# EAGLE design E106 (EAGLE 9.5.1)
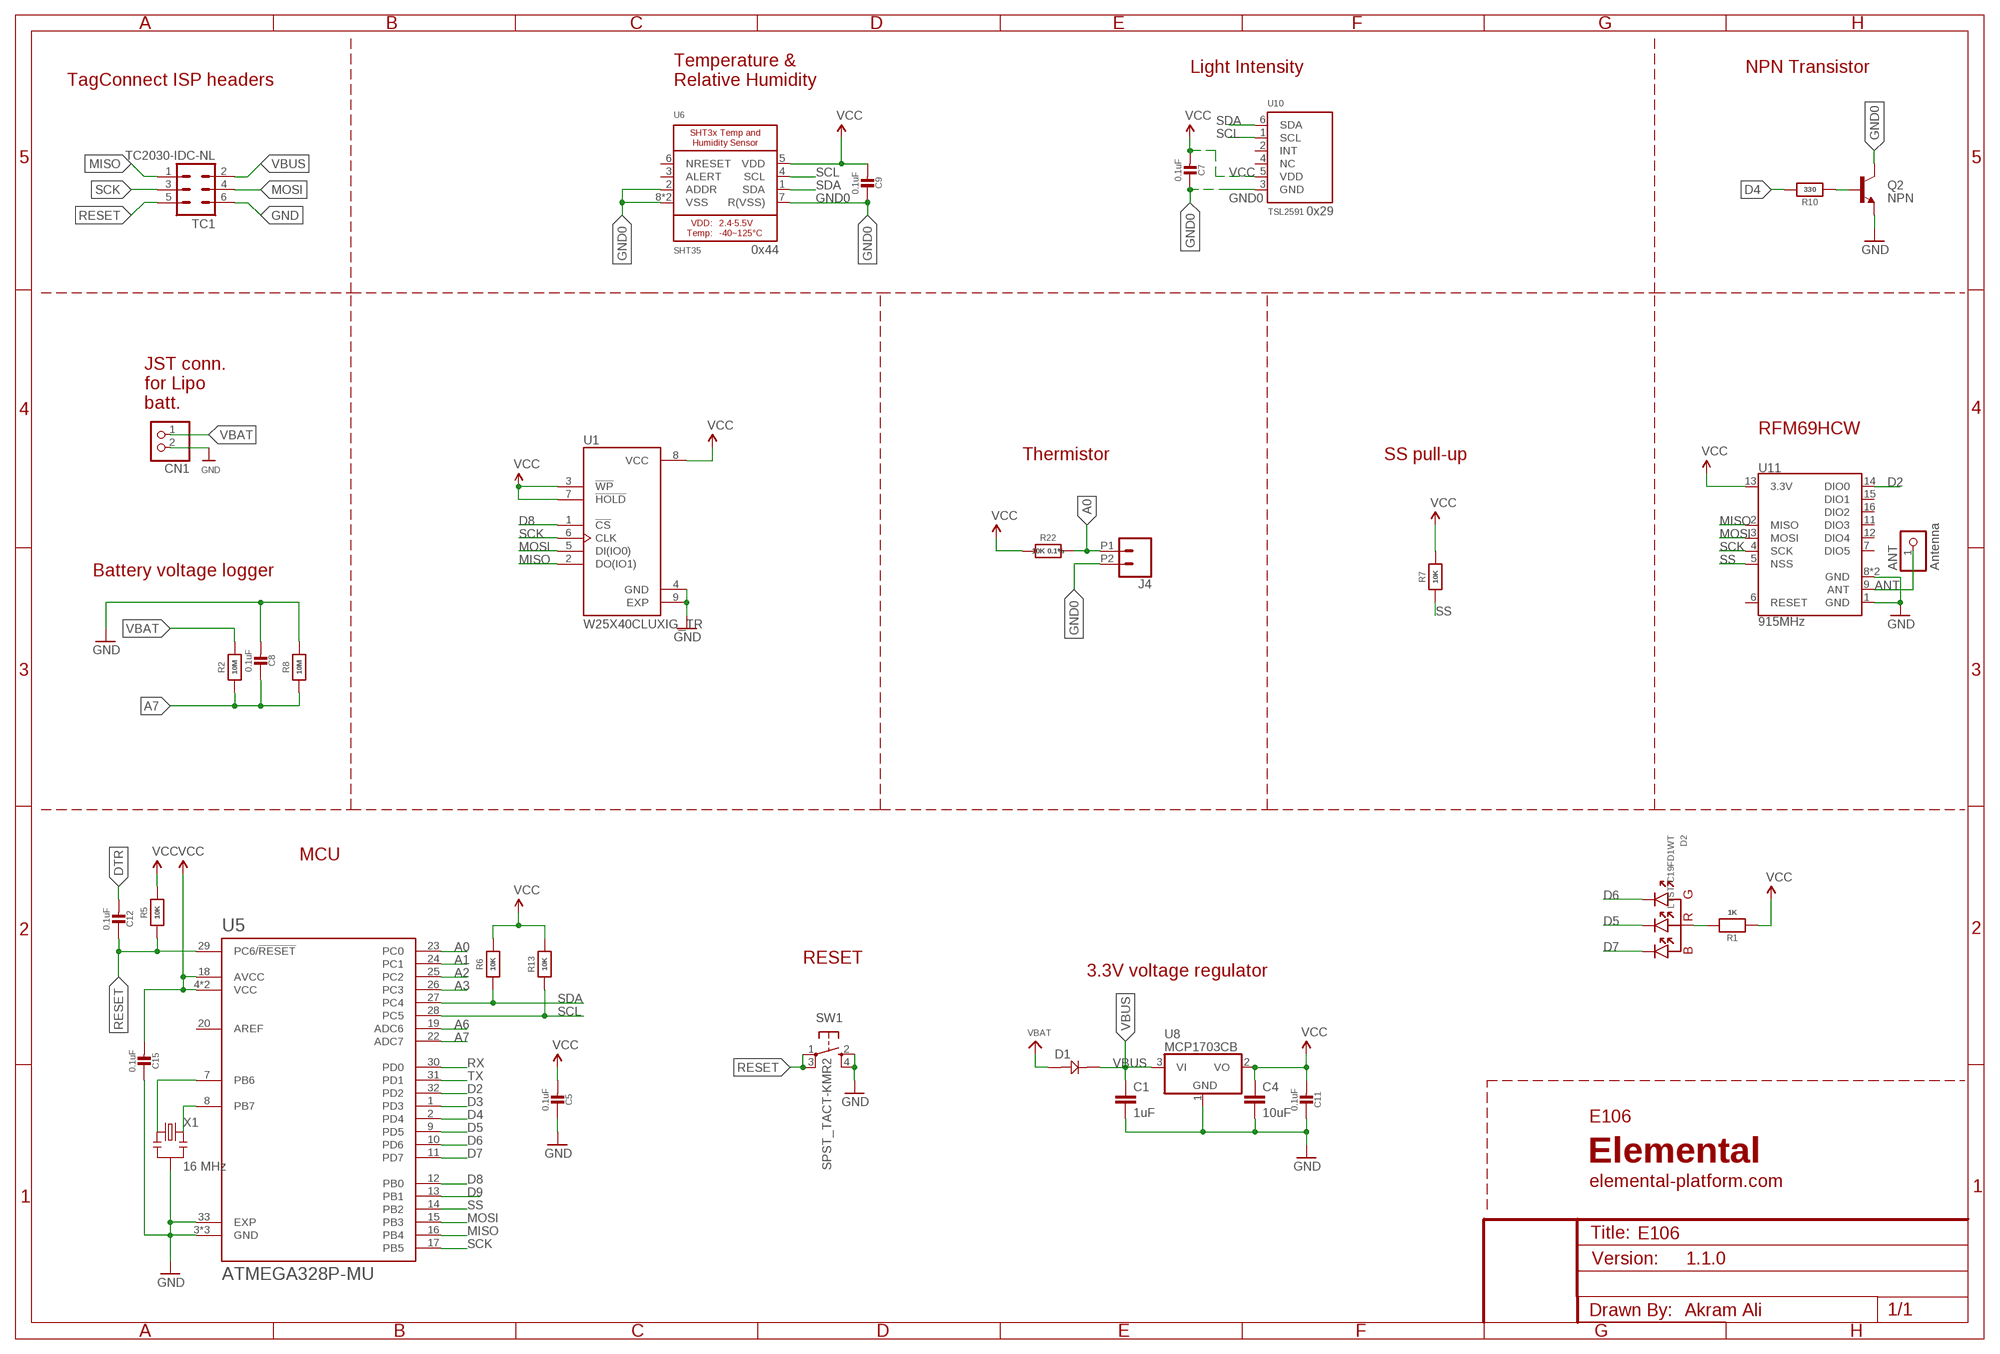
[diagram p0: schematic, sheet 1]

## Parts
ANT  Antenna  PINHD-1X1CB  [1X01-CLEANBIG]
C1  1uF  CAP0805  [0805]
C4  10uF  CAP0805  [0805]
C5  0.1uF  MICROBUILDER_CAP_CERAMIC_0402MP  [MICROBUILDER__0402MP]
C7  0.1uF  MICROBUILDER_CAP_CERAMIC_0402MP  [MICROBUILDER__0402MP]
C8  0.1uF  MICROBUILDER_CAP_CERAMIC_0402MP  [MICROBUILDER__0402MP]
C9  0.1uF  MICROBUILDER_CAP_CERAMIC_0402MP  [MICROBUILDER__0402MP]
C11  0.1uF  MICROBUILDER_CAP_CERAMIC_0402MP  [MICROBUILDER__0402MP]
C12  0.1uF  MICROBUILDER_CAP_CERAMIC_0402MP  [MICROBUILDER__0402MP]
C15  0.1uF  MICROBUILDER_CAP_CERAMIC_0402MP  [MICROBUILDER__0402MP]
CN1  JST_2PIN-SMT-RA  [JST-PH-2-SMT-RA]
D1  DIODE_SCHOTTKY0805-RES  [0805]
D2  LTST-C19FD1WT  [4-SMD]
J4  CONN_022.54MM_SCREWTERM  [1X02_2.54_SCREWTERM]
Q2  NPN  TRANSISTOR_NPNMMBT5088  [SOT23-3@1]
R1  1K  MICROBUILDER_RESISTOR_0402MP  [MICROBUILDER__0402MP]
R2  10M  MICROBUILDER_RESISTOR_0402MP  [MICROBUILDER__0402MP]
R5  10K  MICROBUILDER_RESISTOR_0402MP  [MICROBUILDER__0402MP]
R6  10K  MICROBUILDER_RESISTOR_0402MP  [MICROBUILDER__0402MP]
R7  10K  MICROBUILDER_RESISTOR_0402MP  [MICROBUILDER__0402MP]
R8  10M  MICROBUILDER_RESISTOR_0402MP  [MICROBUILDER__0402MP]
R10  330  MICROBUILDER_RESISTOR_0402MP  [MICROBUILDER__0402MP]
R13  10K  MICROBUILDER_RESISTOR_0402MP  [MICROBUILDER__0402MP]
R22  10K 0.1%  MICROBUILDER_RESISTOR_0402MP  [MICROBUILDER__0402MP]
SW1  SPST_TACT-KMR2  [KMR2]
TC1  TC2030-IDC-NL  [TC2030-IDC-NL]
U1  W25X40CLUXIG_TR  [PSON50P300X200X60-9N]
U5  ATMEGA328P-MU  [QFN50P500X500X100-33N]
U6  SHT35  SHT3X  [SHT3X]
U8  MCP1703CB  [SOT23]
U10  TSL2591  LIGHT_TSL2591  [DFN6_TAOS]
U11  915MHz  RFM69HCW-915  [RFM69HCW-XXXS2]
X1  16 MHz  RESONATORSMD  [RESONATOR-SMD]

## Nets
A0: J4.P1 R22.2 U5.23(PC0)
A1: U5.24(PC1)
A2: U5.25(PC2)
A3: U5.26(PC3)
A6: U5.19(ADC6)
A7: C8.1 R2.1 R8.1 U5.22(ADC7)
ANT: ANT.1 U11.9(ANT)
D2: U5.32(PD2) U11.14(DIO0)
D3: U5.1(PD3)
D4: R10.2 U5.2(PD4)
D5: D2.2(C2) U5.9(PD5)
D6: D2.3(C3) U5.10(PD6)
D7: D2.1(C1) U5.11(PD7)
D8: U1.1(!CS) U5.12(PB0)
D9: U5.13(PB1)
DTR: C12.2
GND: C1.2 C4.2 C5.1 C8.2 C11.1 C15.1 CN1.2 Q2.2(E) R8.2 SW1.2(S) SW1.4(S1) TC1.6 U1.4(GND) U1.9(EXP) U5.3(GND) U5.5(GND) U5.21(GND) U5.33(EXP) U8.1(GND) U11.1(GND) U11.8(GND) U11.10(GND) X1.2
GND0: C7.1 C9.1 J4.P2 Q2.3(C) U6.2(ADDR) U6.7(R(VSS)) U6.8(VSS) U6.THERMAL(VSS) U10.3(GND)
MISO: TC1.1 U1.2(DO(IO1)) U5.16(PB4) U11.2(MISO)
MOSI: TC1.4 U1.5(DI(IO0)) U5.15(PB3) U11.3(MOSI)
N$4: U5.8(PB7) X1.3
N$5: U5.7(PB6) X1.1
N$6: D2.4(A) R1.2
N$7: Q2.1(B) R10.1
RESET: C12.1 R5.1 SW1.1(P) SW1.3(P1) TC1.5 U5.29(PC6/!RESET)
RX: U5.30(PD0)
SCK: TC1.3 U1.6(CLK) U5.17(PB5) U11.4(SCK)
SCL: R13.1 U5.28(PC5) U6.4(SCL) U10.1(SCL)
SDA: R6.1 U5.27(PC4) U6.1(SDA) U10.6(SDA)
SS: R7.1 U5.14(PB2) U11.5(NSS)
TX: U5.31(PD1)
VBAT: CN1.1 D1.1 R2.2
VBUS: C1.1 D1.2 TC1.2 U8.3(VI)
VCC: C4.1 C5.2 C7.2 C9.2 C11.2 C15.2 R1.1 R5.2 R6.2 R7.2 R13.2 R22.1 U1.3(!WP) U1.7(!HOLD) U1.8(VCC) U5.4(VCC) U5.6(VCC) U5.18(AVCC) U6.5(VDD) U8.2(VO) U10.5(VDD) U11.13(3.3V)
Unconnected: U5.20(AREF) U6.3(ALERT) U6.6(NRESET) U10.2(INT) U10.4(NC) U11.6(RESET) U11.7(DIO5) U11.11(DIO3) U11.12(DIO4) U11.15(DIO1) U11.16(DIO2)

## Notes on the sheet
- Light Intensity | NPN Transistor
- TagConnect ISP headers
- Temperature &
  Relative Humidity
- 0x29
- 0x44
- JST conn.
  for Lipo
  batt.
- RFM69HCW
- Thermistor | SS pull-up
- Battery voltage logger
- MCU
- RESET
- 3.3V voltage regulator
- E106
- Elemental
- elemental-platform.com
- 1.1.0
- Akram Ali

## Library data of the parts
ANT = adafruit@1:PINHD-1X1: Pin header 1x1 for 0.1" spacing With round pins; MPN: Helical antenna
C1 = SparkFun-Capacitors:CAP: Capacitor Standard 0603 ceramic capacitor, and 0.1" leaded capacitor.; MPN: CC0805ZRY5V8BB105
C4 = SparkFun-Capacitors:CAP: Capacitor Standard 0603 ceramic capacitor, and 0.1" leaded capacitor.; MPN: CC0805KKX5R6BB106
C5 C7-C9 C11 C12 C15 = Adafruit Feather 32u4 Bluefruit LE:MICROBUILDER_CAP_CERAMIC: Ceramic Capacitors For new designs, use the packages preceded by an '_' character since they are more reliable: The following footprints should be used on most boards: _0402 - Standard footprint for regular board layouts _0603 - Standard footprint for regular board layouts _0805 - Standard footprint for regular board layouts _1206 - Standard footprint for regular board layouts For extremely tight-pitch boards where space is at a premium, the following 'micro-pitch' footprints can be used (smaller pads, no silkscreen outline, etc.): _0402MP - Micro-pitch footprint for very dense/compact boards _0603MP - Micro-pitch footprint for very dense/compact boards _0805MP - Micro-pitch footprint for very dense/compact boards _1206MP - Micro-pitch footprint for very dense/compact boards; MPN: GRM155R71C104KA88J
CN1 = adafruit:JST_2PIN: JST 2-Pin Connectors of various flavors SMT-RA (S2B-PH-SM4) 4UConnector #17311 SMT (B2B-PH-SM4) THM-RA (S2B-PH) THM (B2B-PH)
D1 = SCHOTTKY_0805:DIODE_SCHOTTKY
D2 = LTST-C19FD1WT:LTST-C19FD1WT; AVAILABILITY: Unavailable; DESCRIPTION: Blue/Red/Green 2.1 x 1.6 x 0.55 mm 130° 180/450/180 mcd 3.5/3.5/2 V Chip LED; MF: Lite-On Inc.; MP: LTST-C19FD1WT; PACKAGE: SMD-4 Lite-On; PRICE: None
J4 = SparkFun-Connectors:CONN_02: Multi connection point. Often used as Generic Header-pin footprint for 0.1 inch spaced/style header connections On any of the 0.1 inch spaced packages, you can populate with these: Break Away Headers - Straight <https://www.sparkfun.com/products/116> (PRT-00116) Break Away Male Headers - Right Angle <https://www.sparkfun.com/products/553> (PRT-00553) Female Headers <https://www.sparkfun.com/products/115> (PRT-00115) Break Away Headers - Machine Pin <https://www.sparkfun.com/products/117> (PRT-00117) Break Away Female Headers - Swiss Machine Pin <https://www.sparkfun.com/products/743> (PRT-00743) For SCREWTERMINALS and SPRING TERMINALS visit here: Screw Terimnals on SparkFun.com <https://www.sparkfun.com/search/results?term=Screw+Terminals> (5mm/3.5mm/2.54mm spacing) This device is also useful as a general connection point to wire up your design to another part of your project. Our various solder wires solder well into these plated through hole pads. Hook-Up Wire - Assortment (Stranded, 22 AWG) <https://www.sparkfun.com/products/11375> (PRT-11375) Hook-Up Wire - Assortment (Solid Core, 22 AWG) <https://www.sparkfun.com/products/11367> (PRT-11367) View the entire wire category on our website here <https://www.sparkfun.com/categories/141> Special notes: Molex polarized connector foot print use with: PRT-08233 with associated crimp pins and housings. 2.54_SCREWTERM for use with PRT-10571. 3.5mm Screw Terminal footprints for PRT-08084 5mm Screw Terminal footprints for use with PRT-08432
Q2 = SparkFun-DiscreteSemi:TRANSISTOR_NPN: Generic NPN BJT MMBT2222A - TRANS-08049 (SOT-23, 1A 40V) MPSA42 - TRANS-09116 (SOT-23, 500mA 300V) MMBT5088LT1G - TRANS-11160 (SOT-23, 50 mA 30V) BC547 - COM-08928 <http://www.sparkfun.com/products/8928> (TO-92 45V 100mA) (1.Collector 2.Base 3.Emitter) 2N3904 - COM-00521 <http://www.sparkfun.com/products/521> (TO-92 40V 200mA) (1.Emitter 2.Base 3.Collector) P2N2222A - COM-12852 <http://www.sparkfun.com/products/12852> (TO-92 40V 600mA) (1.Collector 2.Base 3.Emitter); PROD_ID: TRANS-11160; VALUE: MMBT5088
R1 R2 R5-R8 R10 R13 = Adafruit Feather 32u4 Bluefruit LE:MICROBUILDER_RESISTOR: Resistors For new designs, use the packages preceded by an '_' character since they are more reliable: The following footprints should be used on most boards: _0402 - Standard footprint for regular board layouts _0603 - Standard footprint for regular board layouts _0805 - Standard footprint for regular board layouts _1206 - Standard footprint for regular board layouts For extremely tight-pitch boards where space is at a premium, the following 'micro-pitch' footprints can be used (smaller pads, no silkscreen outline, etc.): _0402MP - Micro-pitch footprint for very dense/compact boards _0603MP - Micro-pitch footprint for very dense/compact boards _0805MP - Micro-pitch footprint for very dense/compact boards _1206MP - Micro-pitch footprint for very dense/compact boards; MPN: RC0402JR-0710KL
R22 = Adafruit Feather 32u4 Bluefruit LE:MICROBUILDER_RESISTOR: Resistors For new designs, use the packages preceded by an '_' character since they are more reliable: The following footprints should be used on most boards: _0402 - Standard footprint for regular board layouts _0603 - Standard footprint for regular board layouts _0805 - Standard footprint for regular board layouts _1206 - Standard footprint for regular board layouts For extremely tight-pitch boards where space is at a premium, the following 'micro-pitch' footprints can be used (smaller pads, no silkscreen outline, etc.): _0402MP - Micro-pitch footprint for very dense/compact boards _0603MP - Micro-pitch footprint for very dense/compact boards _0805MP - Micro-pitch footprint for very dense/compact boards _1206MP - Micro-pitch footprint for very dense/compact boards; MPN: RC0402JR-0727RL
SW1 = adafruit:SPST_TACT: SMT 6mm switch, EVQQ2 series http://www.ladyada.net/library/eagle
TC1 = TagConnect:TC2030-IDC: Tag-Connect In Circuit Programming & Debug Cable 6 Pin http://www.tag-connect.com
U1 = W25X40CLUXIG_TR:W25X40CLUXIG_TR: Spiflash, 4m-Bit, 4kb Uniform Se; DESCRIPTION: Spiflash, 4m-Bit, 4kb Uniform Se; DIGI-KEY_PART_NUMBER: W25X40CLUXIGCT-ND; DIGI-KEY_PURCHASE_URL: https://www.digikey.com/product-detail/en/winbond-electronics/W25X40CLUXIG-TR/W25X40CLUXIGCT-ND/5764888?utm_source=snapeda&utm_medium=aggregator&utm_campaign=symbol; MF: Winbond Electronics; MP: W25X40CLUXIG TR; PACKAGE: UFDFN-8 Winbond
U5 = ATMEGA328P-MU:ATMEGA328P-MU: ATmega Series 20 MHz 32 KB Flash 2 KB SRAM 8-Bit Microcontroller - QFN-32; AVAILABILITY: Good; DESCRIPTION: ATmega Series 20 MHz 32 KB Flash 2 KB SRAM 8-Bit Microcontroller - QFN-32; MF: Atmel; MP: ATMEGA328P-MU; MPN: ATMEGA328P-MU; PACKAGE: QFN-32 Atmel; PRICE: 2.55 USD
U6 = Adafruit SHT31:SHT3X: SHT3x - Digital Temperature and Humidity Sensor Supply Voltage: 2.4-5.5V Humidity Accuracy: SHT30 = +/-3%RH, SHT31 = +/-2%RH Temperature Sensor: -40~125°C (+/-0.3°C from 10-55C); MPN: SHT35-DIS-B
U8 = linear:MCP1703: 250 mA, 16V, Low Quiescent Current LDO Regulator Source: http://ww1.microchip.com/downloads/en/DeviceDoc/22049b.pdf; MPN: MCP1703T-3302E/CB; OC_NEWARK: 18T9177
U10 = TSL2591:LIGHT_TSL2591: TSL2591 Light-To-Digital Sensor; MPN: TSL25911FN
U11 = SparkFun-RF:RFM69H: Hope RF RFM69H ISM Transceiver Module The RFM69H is a transceiver module capable of operation over a wide frequency range, including the 315,433,868 and 915MHz license-free ISM (Industry Scientific and Medical) frequency bands. All major RF communication parameters are programmable and most of them can be dynamically set. The RFM69H offers the unique advantage of programmable narrow-band and wide- band communication modes. The RFM69H is optimized for low power consumption while offering high RF output power and channelized operation.Compliance ETSI and FCC regulations. Datasheet <http://www.hoperf.cn/upload/docs/RF/SX/RFM69H_DataSheet_v1.3.pdf> SparkFun Products RFM69HCW Wireless Transceiver - 915MHz <https://www.sparkfun.com/products/13909> (COM-13909) RFM69HCW Wireless Transceiver - 434MHz <https://www.sparkfun.com/products/13910> (COM-13910) SparkFun RFM69 Breakout (915MHz) <https://www.sparkfun.com/products/12775> (WRL-12775) SparkFun RFM69 Breakout (434MHz) <https://www.sparkfun.com/products/12823> (WRL-12823); MPN: RFM69HCW; PROD_ID: IC-11997
X1 = SparkFun:RESONATOR: Resonator Small SMD resonator. This is the itty bitty 10/20MHz resonators with built in caps. CSTCE10M0G55 and CSTCE20M0V53. Footprint has been reviewed closely but hasn't been tested yet.; MPN: CSTCE16M0V53-R0

## Net classes
1 power: width 0.381 mm, clearance 0.254 mm

## Board
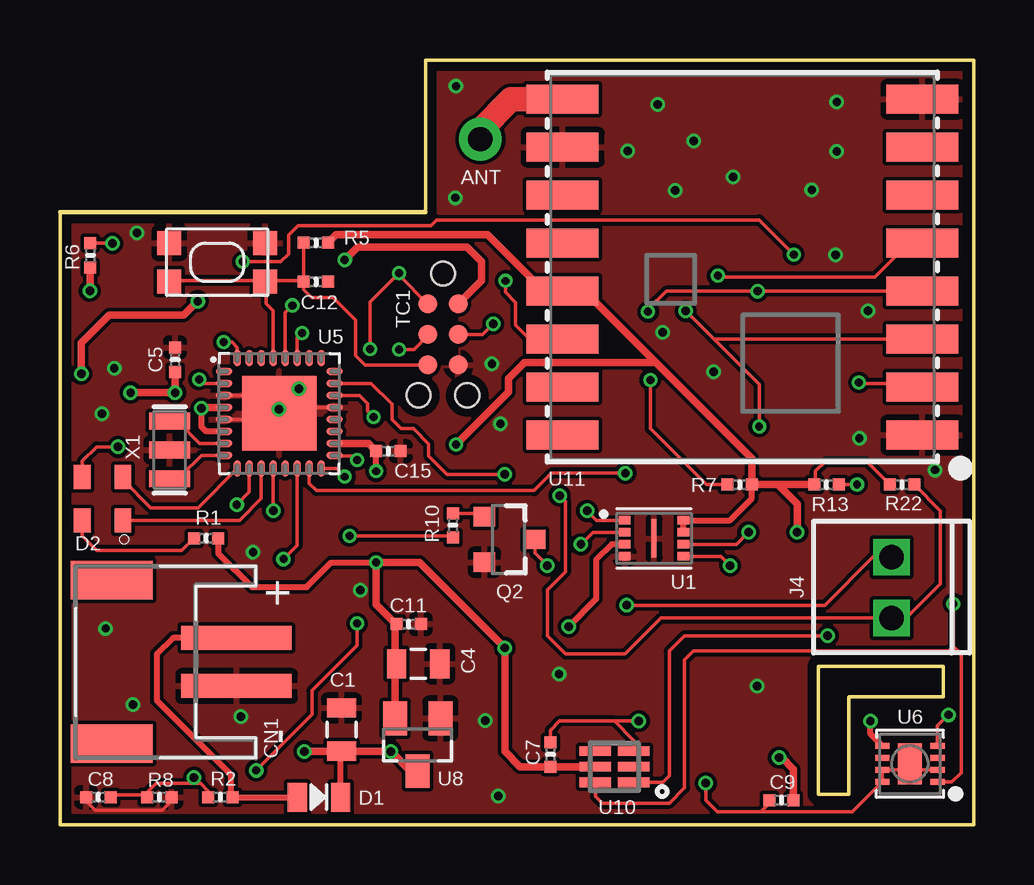
[diagram p1: board, top side]
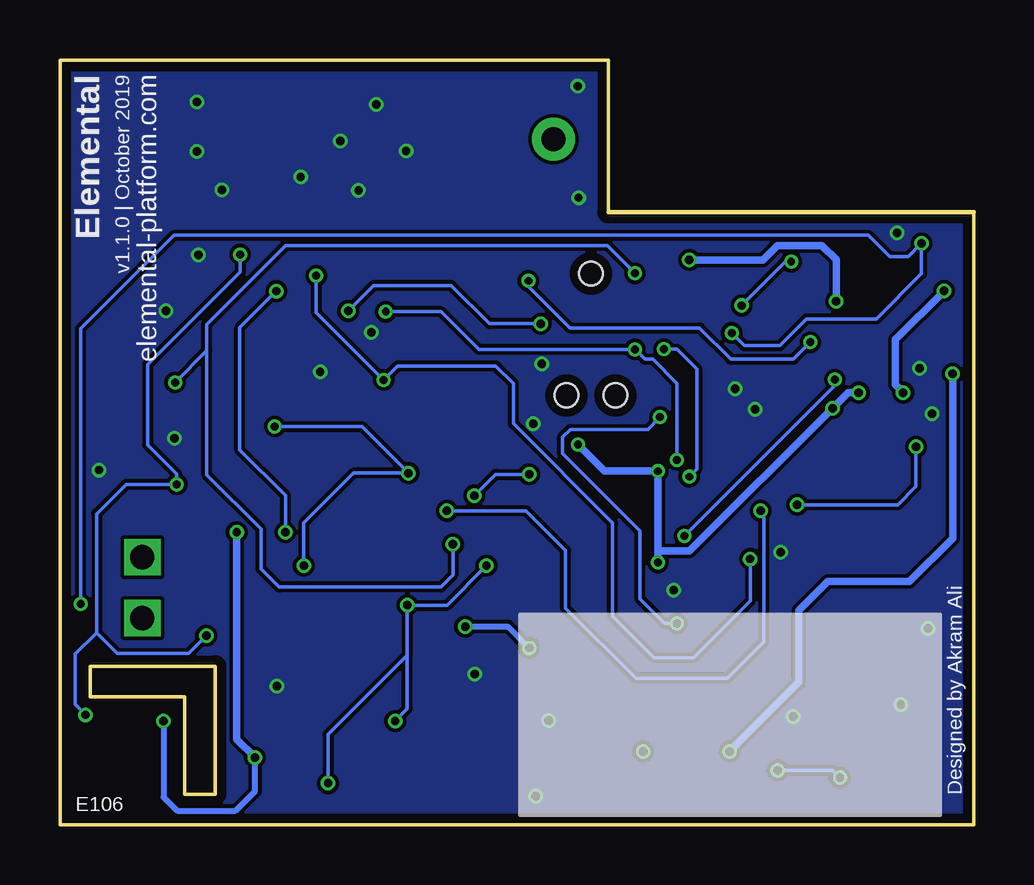
[diagram p2: board, bottom side, seen from below]

Size 38.1 x 31.88 mm. Coordinates in mm from the lower left corner, seen from the top.
Outline: 0,25.53 15.24,25.53 15.24,31.88 38.1,31.88 38.1,0 0,0 0,25.53
Outline: 36.83,6.6 31.62,6.6 31.62,1.27 32.89,1.27 32.89,5.33 36.83,5.33 36.83,6.6
Copper layers (1*16): Top 0.035559375mm / dielectric 1.6mm / Bottom 0.035559375mm
Design rules "oshpark-2layer *": minimum track width 6mil, minimum drill 10mil, track to track 6mil, track to pad 6mil, pad to pad 6mil, via to via 6mil, smd to smd 6mil, copper to edge 15mil, drill to drill 6mil, minimum pad ring 5mil, minimum via ring 5mil, stop-mask expansion 2.5mil, vias tented up to drill 14mil, thermal gap 10mil

### Footprints (pad centres in the part's own frame; a part is rotated, then mirrored left to right if it is on the bottom)
1X01-CLEANBIG = drill 1.016 pad 1.778: 1 0,0
0805 = smd 0.8 x 1.2: 1 -0.9,0; 2 0.9,0
MICROBUILDER__0402MP = smd 0.5 x 0.5: 1 -0.508,0; 2 0.508,0
JST-PH-2-SMT-RA = smd 1 x 4.6: 1 1,-3.7; 2 -1,-3.7 | smd 1.6 x 3.4: NC1 -3.4,1.5; NC2 3.4,1.5
4-SMD = smd 1 x 0.7: 1 0.9,0.85; 2 -0.9,0.85; 3 -0.9,-0.85; 4 0.9,-0.85
1X02_2.54_SCREWTERM = drill 1.016 square: P1 2.54,0; P2 0,0
SOT23-3@1 = smd 0.8 x 0.9: 1 -0.95,-1; 2 0.95,-1; 3 0,1.1
KMR2 = smd 1 x 1: 1 2,0.8; 2 2,-0.8; 3 -2,0.8; 4 -2,-0.8
TC2030-IDC-NL = smd 0.787 x 0.787: 1 -1.27,-0.635; 2 -1.27,0.635; 3 0,-0.635; 4 0,0.635; 5 1.27,-0.635; 6 1.27,0.635 | hole 0.991: -2.54,0; 2.54,1.016; 2.54,-1.016
PSON50P300X200X60-9N = smd 0.49 x 0.35: 1 -1.22,0.75; 2 -1.22,0.25; 3 -1.22,-0.25; 4 -1.22,-0.75; 5 1.22,-0.75; 6 1.22,-0.25; 7 1.22,0.25; 8 1.22,0.75 | smd 0.2 x 1.6: 9 0,0
QFN50P500X500X100-33N = smd 0.7 x 0.3: 1 -2.3,1.75; 2 -2.3,1.25; 3 -2.3,0.75; 4 -2.3,0.25; 5 -2.3,-0.25; 6 -2.3,-0.75; 7 -2.3,-1.25; 8 -2.3,-1.75; 17 2.3,-1.75; 18 2.3,-1.25; 19 2.3,-0.75; 20 2.3,-0.25; 21 2.3,0.25; 22 2.3,0.75; 23 2.3,1.25; 24 2.3,1.75 | smd 0.3 x 0.7: 9 -1.75,-2.3; 10 -1.25,-2.3; 11 -0.75,-2.3; 12 -0.25,-2.3; 13 0.25,-2.3; 14 0.75,-2.3; 15 1.25,-2.3; 16 1.75,-2.3; 25 1.75,2.3; 26 1.25,2.3; 27 0.75,2.3; 28 0.25,2.3; 29 -0.25,2.3; 30 -0.75,2.3; 31 -1.25,2.3; 32 -1.75,2.3 | smd 3.1 x 3.1: 33 0,0
SHT3X = smd 0.6 x 0.25: 1 -1.15,0.75; 2 -1.15,0.25; 3 -1.15,-0.25; 4 -1.15,-0.75; 5 1.15,-0.75; 6 1.15,-0.25; 7 1.15,0.25; 8 1.15,0.75 | smd 1 x 1.7: THERMAL 0,0
SOT23 = smd 1 x 1.4: 1 -0.95,-1.1; 2 0.95,-1.1; 3 0,1.1
DFN6_TAOS = smd 1.3 x 0.4: 1 -0.8,0.65; 2 -0.8,0; 3 -0.8,-0.65; 4 0.8,-0.65; 5 0.8,0; 6 0.8,0.65
RFM69HCW-XXXS2 = smd 3 x 1.2: 1 -7.5,7; 2 -7.5,5; 3 -7.5,3; 4 -7.5,1; 5 -7.5,-1; 6 -7.5,-3; 7 -7.5,-5; 8 -7.5,-7; 9 7.5,-7; 10 7.5,-5; 11 7.5,-3; 12 7.5,-1; 13 7.5,1; 14 7.5,3; 15 7.5,5; 16 7.5,7
RESONATOR-SMD = smd 0.7 x 1.7: 1 -1.2,0; 2 0,0; 3 1.2,0

### Placement (x,y rotation side)
ANT  17.53,28.57 0 top
C1  11.73,3.96 90 top
C4  14.94,6.71 0 top
C5  4.8,19.38 270 top
C7  20.45,2.92 270 top
C8  1.6,1.14 180 top
C9  30.07,1.02 0 top
C11  14.54,8.36 180 top
C12  10.67,22.63 0 top
C15  13.69,15.57 180 top
CN1  3.66,6.78 90 top
D1  10.79,1.14 0 top
D2  1.78,13.59 270 top
J4  34.67,11.15 270 top
Q2  18.69,11.89 270 top
R1  6.1,11.94 180 top
R2  6.68,1.14 0 top
R5  10.67,24.26 0 top
R6  1.27,23.72 270 top
R7  28.33,14.17 0 top
R8  4.14,1.14 0 top
R10  16.38,12.47 270 top
R13  31.95,14.17 180 top
R22  35.1,14.17 0 top
SW1  6.55,23.44 180 top
TC1  15.96,20.43 270 top
U1  24.77,11.94 0 top
U5  9.14,17.15 0 top
U6  35.43,2.53 180 top
U8  14.91,3.33 180 top
U10  23.11,2.41 180 top
U11  28.45,23.24 180 top
X1  4.57,15.62 270 top

### Tracks (layer width: path | path; a pad name or v marks a point on that pad's centre or on a via)
A0  (via drill 0.35)
  Top 0.152: R22.2 36.7,13.08 36.7,10.03 35.28,8.61 J4.P1 25.04,8.61 23.55,7.11 21.08,7.11 20.32,7.87 20.32,9.78 21.08,10.54 21.08,13.46 v20.83,13.72 | U5.23 12.97,18.4 13.84,17.53 13.84,16.89 14.22,16.51 14.73,16.51 15.37,15.88 15.37,15.37 16.13,14.6 v18.54,14.6
  Bottom 0.152: v20.83,13.72 19.94,14.6 v18.54,14.6
A7  (via drill 0.33, 0.35)
  Top 0.152: C8.1 2.22,1.24 3.49,1.24 R8.1 3.63,1.35 4,1.71 5.35,1.71 | R2.1 6.17,1.4 5.86,1.71 5.35,1.71 | v12.38,8.38 12.38,7.46 10.51,5.59 10.51,4.59 v8.18,2.26 | U5.22 12.49,17.9 12.83,17.56 12.83,17.24 v13.08,16.99 | v5.59,1.96 5.35,1.71
  Bottom 0.152: v12.38,8.38 12.9,8.38 13.92,9.4 13.92,12.24 17.14,15.47 17.14,16.16 16.83,16.48 13.59,16.48 v13.08,16.99 | v8.18,2.26 5.89,2.26 v5.59,1.96
ANT
  Top 1.016: U11.9 18.81,30.24 17.53,28.96 ANT.1
D2  (via drill 0.33)
  Top 0.152: v18.57,22.67 18.57,22.19 19,21.77 19,20.83 19.54,20.29 20.8,20.29 U11.14 | U5.32 7.39,19.89 7.17,20.11 v6.82,20.11
  Bottom 0.152: v18.57,22.67 18.57,22.43 16.84,20.7 11.44,20.7 10.14,19.41 7.53,19.41 v6.82,20.11
D4  (via drill 0.33)
  Top 0.152: U5.2 5.96,18.4 v5.8,18.55 | R10.2 16.31,12.03 v12.06,12.03
  Bottom 0.152: v12.06,12.03 5.8,18.3 v5.8,18.55
D5
  Top 0.152: U5.9 5.76,13.21 3.78,13.21 2.63,14.36 D2.2
D6  (via drill 0.35)
  Top 0.152: U5.10 7.89,13.86 v7.37,13.34 | D2.3 0.93,15.15 1.52,15.75 v2.41,15.75
  Bottom 0.152: v7.37,13.34 3.17,13.34 2.41,14.1 v2.41,15.75
D7
  Top 0.152: U5.11 8.39,13.6 7.48,12.69 D2.1
D8  (via drill 0.35)
  Top 0.152: U5.12 v8.89,13.09 v8.89,13.08 | v21.97,13.08 22.36,12.69 U1.1
  Bottom 0.152: v21.97,13.08 18.67,13.08 17.02,11.43 17.02,9.02 14.1,6.1 10.29,6.1 8.76,7.62 8.76,12.95 v8.89,13.08
GND  (via drill 0.35)
  Top 0.152: U5.21 10.72,17.4 v9.96,18.16 | U5.5 8.69,16.9 v9.12,17.32 8.55,17.9 U5.3 | C8.2 1.09,0.97 1.46,0.6 4.25,0.6 4.65,1 R8.2
  other vias: 7.54,4.5 18.01,19.2 24.92,30.02 26.42,28.5 31.34,26.47 28.07,27 16.51,30.78 16.48,26.14 3.05,5 33.32,16.1 8.05,11.35 3.2,24.66 2.26,19.02 1.91,8.18 18.36,16.71 27.25,18.87 33.68,21.41 32.33,23.75 25.65,26.44 32.38,30.12 23.67,28.09 32.38,28.07 25.12,20.52 17.73,4.34 36.47,14.78 12.52,9.78 18.26,1.19 29.06,5.77 20.8,6.27 1.75,17.12
  pour Top (rank 6): 39.37,33.15 39.37,-1.27 -1.27,-1.27 -1.27,33.15
  pour Bottom: -1.52,33.4 39.62,33.4 39.62,-1.52 -1.52,-1.52
GND0  (via drill 0.35)
  Top 0.152: J4.P2 33.88,11.15 31.88,9.14 v23.62,9.14 | U6.2 35.68,2.28 U6.THERMAL 35.18,2.28 U6.7 U6.8 33.04,0.53 29.21,0.53 | 29.21,0.53 27.41,0.53 26.92,1.02 v26.92,1.73 | v20.32,10.8 19.79,11.32 Q2.3 | C9.1 29.57,0.89 29.21,0.53 | C7.1 20.45,3.94 20.83,4.32 23.11,4.32 | U10.3 23.91,3.52 23.11,4.32 | 23.11,4.32 v24.13,4.32
  Bottom 0.152: v20.32,10.8 21.97,9.14 v23.62,9.14 23.62,7.06 | 23.62,7.06 26.92,3.76 v26.92,1.73 | v24.13,4.32 23.62,4.83 23.62,7.06
MISO  (via drill 0.33, 0.35)
  Top 0.152: U11.2 35.88,18.38 33.35,18.38 v33.31,18.43 | U5.16 11.53,14.84 v11.87,14.5 | v12.92,19.82 12.92,21.78 v14.13,22.99 14.13,22.9 TC1.1 | U1.2 22.22,12.19 v21.72,11.68
  Bottom 0.152: v33.31,18.43 31.98,19.76 31.98,19.81 | 31.98,19.81 31.98,20.85 28.7,24.13 15.27,24.13 v14.13,22.99 | v11.87,14.5 11.56,14.81 11.56,19 12.38,19.82 v12.92,19.82 | v21.72,11.68 21.72,10.41 22.23,9.91 28.96,9.91 29.72,10.67 29.72,12.32 31.98,14.58 31.98,19.81
MOSI  (via drill 0.33, 0.35)
  Top 0.152: v18.06,20.88 17.61,20.43 TC1.4 | v26.09,21.41 27.26,20.24 | v23.57,14.66 20.5,14.66 19.76,13.92 10.69,13.92 10.39,14.22 U5.15 | U11.3 27.26,20.24 | v29.15,16.59 29.15,18.35 27.26,20.24 | v27.94,10.8 27.55,11.19 U1.5
  Bottom 0.152: v18.06,20.88 20.19,20.88 21.79,22.48 25.02,22.48 v26.09,21.41 | v29.15,16.59 25.51,16.59 v23.57,14.66 25.86,14.66 27.94,12.57 v27.94,10.8
N$4
  Top 0.152: X1.3 4.6,14.57 5.08,14.57 5.9,15.4 U5.8
N$5
  Top 0.152: X1.1 4.6,16.8 4.92,16.8 5.82,15.9 U5.7
N$6
  Top 0.152: R1.2 5.08,11.43 1.52,11.43 0.93,12.03 D2.4
N$7
  Top 0.152: R10.1 17.55,12.98 Q2.1
RESET
  Top 0.152: 8.89,22.67 8.57,22.67 SW1.3 | 8.89,22.67 10.16,22.67 | 10.16,22.67 R5.1 | 10.16,22.67 C12.1 10.16,22.3 10.49,21.97 11.38,21.97 12.32,21.03 12.32,19.56 12.71,19.16 TC1.5 | 8.89,22.67 SW1.3 | SW1.1 4.6,22.67 8.41,22.67 SW1.3 | U5.29 8.89,21.43 8.6,21.73 8.6,22.6 SW1.3
SCK  (via drill 0.33, 0.35)
  Top 0.152: v12.38,15.21 12.22,15.37 11.59,15.37 U5.17 | v14.13,19.81 14.76,19.81 15.33,20.38 TC1.3 | U11.4 v29.08,22.24 25.28,22.24 24.52,21.48 v24.52,21.38 | U1.6 28.2,11.69 v28.7,12.19
  Bottom 0.152: v24.52,21.38 22.21,21.38 20.64,19.81 v14.13,19.81 13.72,19.4 13.39,19.4 12.38,18.4 v12.38,15.21 | v29.08,22.24 30.61,20.72 30.61,15.62 28.7,13.72 v28.7,12.19
SCL  (via drill 0.33, 0.35)
  Top 0.152: v7.62,23.46 9.21,23.46 9.53,23.78 9.53,24.57 9.93,24.98 15.47,24.98 15.7,25.21 29.15,25.21 v30.59,23.77 | U5.28 9.39,21.35 v9.69,21.64 | R13.1 33.22,14.17 v33.23,14.19 | U6.4 36.58,4.12 v37.04,4.58 | v32,7.87 26.04,7.87 25.4,7.24 25.4,2.03 25.13,1.76 U10.1
  Bottom 0.152: v9.69,21.64 7.86,23.46 v7.62,23.46 | v30.59,23.77 30.59,23.04 34.45,19.18 34.45,15.83 33.23,14.61 v33.23,14.19 35.34,14.19 36.58,12.95 36.58,8 | 36.58,8 37.47,7.11 37.47,5 v37.04,4.58 | 36.58,8 35.71,7.14 32.74,7.14 v32,7.87
SDA  (via drill 0.33, 0.35)
  Top 0.152: v10.1,20.5 9.89,20.29 U5.27 | v2.18,24.23 R6.1 | U6.1 37.19,1.78 37.57,2.16 37.57,7.11 37.24,7.44 | v37.24,9.21 37.24,7.49 37.24,7.44 | U10.6 22.31,1.18 22.61,0.89 25.4,0.89 26.04,1.52 26.04,6.86 26.42,7.24 37.05,7.24 37.24,7.44
  Bottom 0.152: v10.1,20.5 9.57,19.97 8.1,19.97 6.99,21.08 4.06,21.08 2.18,22.96 v2.18,24.23 2.74,23.67 3.5,23.67 4.41,24.57 33.34,24.57 37.24,20.67 v37.24,9.21
SS  (via drill 0.33, 0.35)
  Top 0.152: U11.5 35.88,24.1 35.24,24.1 33.97,22.83 27.47,22.83 v27.42,22.88 | U5.14 9.89,12.35 9.89,12.34 9.89,11.64 v9.32,11.07 | R7.1 26.94,14.17 24.61,16.51 v24.61,18.54
  Bottom 0.152: v27.42,22.88 27.42,21.35 v24.61,18.54 24.02,19.13 19.94,19.13 19.2,18.39 19.2,16.71 15.06,12.57 15.06,8.68 13.34,6.95 11.68,6.95 9.32,9.31 v9.32,11.07
VBAT
  Top 0.254: CN1.1 4.71,7.78 4.04,7.11 4.04,5.18 7.14,2.08 7.14,1.24 R2.2 D1.1
VBUS  (via drill 0.35)
  Top 0.254: C1.1 11.72,3.05 11.7,3.02 D1.2 | 13.78,3.06 v13.79,3.05 | U8.3 14.61,2.23
  Top 0.305: v11.87,23.54 12.4,24.08 16.97,24.08 17.58,23.47 17.58,22.68 TC1.2 | v5.74,21.82 5.16,21.23 2.06,21.23 0.89,20.07 v0.89,18.8 | v10.19,3.05 11.72,3.05 | C1.1 13.78,3.06 | 14.61,2.23 v13.79,3.05
  Bottom 0.305: v11.87,23.54 8.79,23.54 8.19,24.14 6.34,24.14 5.74,23.55 v5.74,21.82 | v10.19,3.05 7.29,5.94 7.29,8.93 6.1,10.13 4.6,10.13 2.7,10.13 0.89,11.94 v0.89,18.8
VCC  (via drill 0.33, 0.35)
  Top 0.152: 13.97,6.79 C4.1 13.96,6.63 | 13.97,8.38 C11.2 | 20.8,22.35 U11.13 20.95,22.19 | v13.18,14.73 v13.18,14.74 | 5.89,16.59 5.9,16.59 | R22.1 33.66,15.11 31.88,15.11 31.5,14.73 31.5,14.22 R13.2
  Top 0.254: 13.97,8.22 C11.2 | v13.18,14.74 C15.2 | U5.6 6.08,16.4 5.89,16.59 | 5.9,16.59 v5.9,17.35 5.94,17.4 | 1.27,22.28 v1.25,22.25 | U6.5 33.78,3.78 v33.78,4.32 | R7.2 28.84,13.6 27.93,12.69 U1.8 U1.7 | U1.3 22.99,11.69 22.35,11.05 22.35,9.4 v21.21,8.26 | R1.1 6.6,11.3 8,9.91 10.29,9.91 11.3,10.92 v13.18,10.92
  Top 0.305: 13.97,6.79 13.97,8.22 | 13.97,8.38 13.18,9.18 v13.18,10.92 14.99,10.92 v18.54,7.37 18.54,3.05 19.18,2.41 C7.2 U10.5 | 24.85,19.25 21.91,22.19 20.95,22.19 | R5.2 11.51,24.59 17.83,24.59 20.07,22.35 20.8,22.35 | U5.18 12.86,15.9 C15.2 | C5.2 v4.8,18.01 v2.95,18.01 | U8.2 13.96,6.63 | v16.51,15.84 18.69,18.03 18.69,18.59 19.36,19.25 24.85,19.25 | U5.4 5.94,17.4 | R13.2 29.92,14.17 | R6.2 1.27,22.28 | v29.97,2.79 30.1,2.79 30.58,2.31 C9.2 | v30.73,12.19 30.73,13.36 29.92,14.17 | 24.85,19.25 28.84,15.26 R7.2 29.92,14.17
  Bottom 0.254: v33.78,4.32 33.78,1.14 33.22,0.58 30.79,0.58 29.97,1.4 v29.97,2.79 | v21.21,8.26 19.43,8.26 v18.54,7.37
  Bottom 0.305: v13.18,10.92 13.18,11.4 | 13.18,11.4 v13.18,14.73 15.4,14.73 v16.51,15.84 | 13.18,11.4 11.85,11.4 v5.9,17.35 5.24,18.01 v4.8,18.01 | v1.25,22.25 3.28,20.22 3.28,18.34 v2.95,18.01 | v30.73,12.19 30.73,3.56 v29.97,2.79

### Text on the board
_bsilk: elemental-platform.com | v1.1.0 | October 2019 | Elemental | Designed by Akram Ali | E106